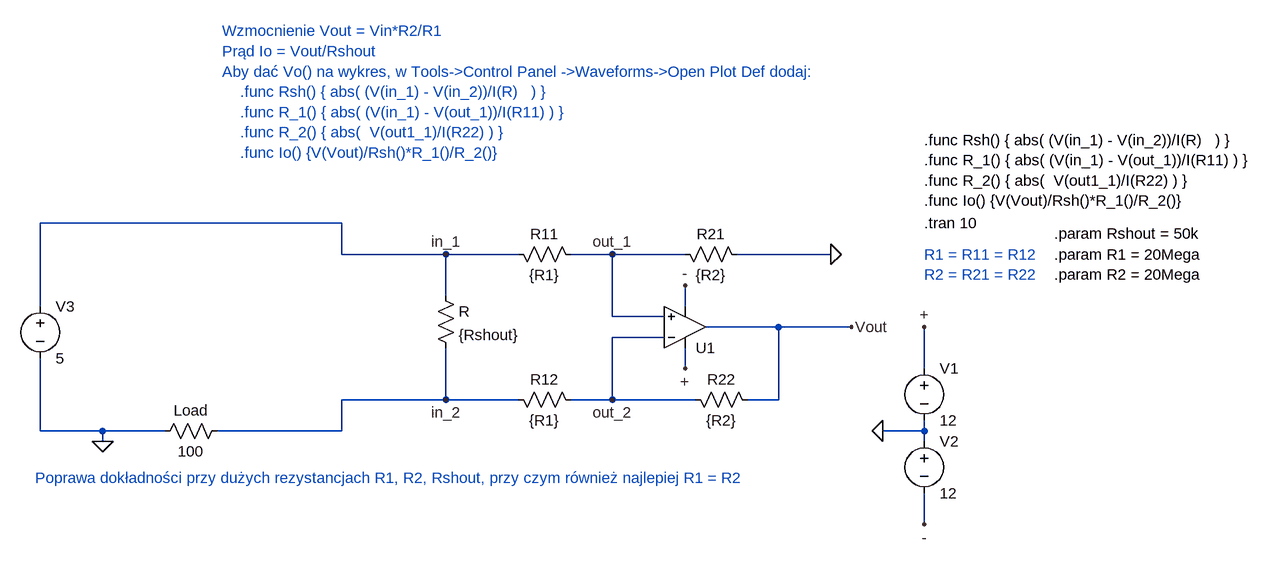
[diagram p0: schematic current_meas.asc]
current_meas.asc, the LTspice schematic file:
Version 4
SHEET 1 1700 680
WIRE 128 -192 -336 -192
WIRE 128 -144 128 -192
WIRE 288 -144 128 -144
WIRE 400 -144 288 -144
WIRE 544 -144 480 -144
WIRE 656 -144 544 -144
WIRE 880 -144 736 -144
WIRE 288 -80 288 -144
WIRE -336 -64 -336 -192
WIRE 656 -64 656 -96
WIRE 544 -48 544 -144
WIRE 624 -48 544 -48
WIRE 800 -32 688 -32
WIRE 912 -32 800 -32
WIRE 624 -16 544 -16
WIRE 656 32 656 0
WIRE 1024 32 1024 -32
WIRE 288 80 288 0
WIRE 288 80 128 80
WIRE 400 80 288 80
WIRE 544 80 544 -16
WIRE 544 80 480 80
WIRE 672 80 544 80
WIRE 800 80 800 -32
WIRE 800 80 752 80
WIRE -336 128 -336 16
WIRE -240 128 -336 128
WIRE -144 128 -240 128
WIRE 128 128 128 80
WIRE 128 128 -64 128
WIRE 1024 128 1024 112
WIRE 1024 128 960 128
WIRE -240 144 -240 128
WIRE 1024 144 1024 128
WIRE 1024 272 1024 224
FLAG 656 32 +
FLAG 960 128 0
FLAG 1024 -32 +
FLAG 656 -96 -
FLAG 1024 272 -
FLAG 880 -144 0
FLAG -240 144 0
FLAG 912 -32 Vout
FLAG 288 -144 in_1
FLAG 288 80 in_2
FLAG 544 -144 out_1
FLAG 544 80 out_2
SYMBOL Opamps\\UniversalOpamp2 656 -32 M180
SYMATTR InstName U1
SYMBOL voltage 1024 16 R0
SYMATTR InstName V1
SYMATTR Value 12
SYMBOL voltage 1024 128 R0
SYMATTR InstName V2
SYMATTR Value 12
SYMBOL res 768 96 M270
WINDOW 0 32 56 VTop 2
WINDOW 3 0 56 VBottom 2
SYMATTR InstName R22
SYMATTR Value {R2}
SYMBOL res 752 -128 M270
WINDOW 0 32 56 VTop 2
WINDOW 3 0 56 VBottom 2
SYMATTR InstName R21
SYMATTR Value {R2}
SYMBOL res 496 96 M270
WINDOW 0 32 56 VTop 2
WINDOW 3 0 56 VBottom 2
SYMATTR InstName R12
SYMATTR Value {R1}
SYMBOL res 496 -128 M270
WINDOW 0 32 56 VTop 2
WINDOW 3 0 56 VBottom 2
SYMATTR InstName R11
SYMATTR Value {R1}
SYMBOL voltage -336 -80 R0
WINDOW 123 0 0 Left 2
WINDOW 39 0 0 Left 2
SYMATTR InstName V3
SYMATTR Value 5
SYMBOL res -48 112 R90
WINDOW 0 0 56 VBottom 2
WINDOW 3 32 56 VTop 2
SYMATTR InstName Load
SYMATTR Value 100
SYMBOL res 272 -96 R0
SYMATTR InstName R
SYMATTR Value {Rshout}
TEXT 1024 -192 Left 2 !.tran 10
TEXT 1224 -176 Left 2 !.param Rshout = 50k
TEXT 1024 -320 Left 2 !.func Rsh() { abs( (V(in_1) - V(in_2))/I(R)   ) }\n.func R_1() { abs( (V(in_1) - V(out_1))/I(R11) ) }\n.func R_2() { abs(  V(out1_1)/I(R22) ) }\n.func Io() {V(Vout)/Rsh()*R_1()/R_2()}
TEXT -56 -488 Left 2 ;Wzmocnienie Vout = Vin*R2/R1\nPrąd Io = Vout/Rshout\nAby dać Vo() na wykres, w Tools->Control Panel ->Waveforms->Open Plot Def dodaj:\n    .func Rsh() { abs( (V(in_1) - V(in_2))/I(R)   ) }\n    .func R_1() { abs( (V(in_1) - V(out_1))/I(R11) ) }\n    .func R_2() { abs(  V(out1_1)/I(R22) ) }\n    .func Io() {V(Vout)/Rsh()*R_1()/R_2()}
TEXT -344 200 Left 2 ;Poprawa dokładności przy dużych rezystancjach R1, R2, Rshout, przy czym również najlepiej R1 = R2
TEXT 1024 -144 Left 2 ;R1 = R11 = R12\nR2 = R21 = R22
TEXT 1224 -144 Left 2 !.param R1 = 20Mega\n.param R2 = 20Mega

The netlist it stands for:
* current_meas.asc
XU1 out_1 out_2 + - Vout level.2 Avol=1Meg GBW=10Meg Slew=10Meg ilimit=25m rail=0 Vos=0 phimargin=45 en=0 enk=0 in=0 ink=0 Rin=500Meg  ; pins IN+ IN- V+ V- OUT
V1 + 0 12
V2 0 - 12
R22 Vout out_2 {R2}
R21 0 out_1 {R2}
R12 out_2 in_2 {R1}
R11 out_1 in_1 {R1}
V3 in_1 0 5
R§Load in_2 0 100
R in_1 in_2 {Rshout}
.tran 10
.param Rshout = 50k
.func Rsh() { abs( (V(in_1) - V(in_2))/I(R)   ) }
.func R_1() { abs( (V(in_1) - V(out_1))/I(R11) ) }
.func R_2() { abs(  V(out1_1)/I(R22) ) }
.func Io() {V(Vout)/Rsh()*R_1()/R_2()}
* Wzmocnienie Vout = Vin*R2/R1
* Prąd Io = Vout/Rshout
* Aby dać Vo() na wykres, w Tools->Control Panel ->Waveforms->Open Plot Def dodaj:
*     .func Rsh() { abs( (V(in_1) - V(in_2))/I(R)   ) }
*     .func R_1() { abs( (V(in_1) - V(out_1))/I(R11) ) }
*     .func R_2() { abs(  V(out1_1)/I(R22) ) }
*     .func Io() {V(Vout)/Rsh()*R_1()/R_2()}
* Poprawa dokładności przy dużych rezystancjach R1, R2, Rshout, przy czym również najlepiej R1 = R2
* R1 = R11 = R12
* R2 = R21 = R22
.param R1 = 20Mega
.param R2 = 20Mega
.lib UniversalOpamps2.sub
.backanno
.end